# Altium schematic sheet catalog.SchDoc
size A4
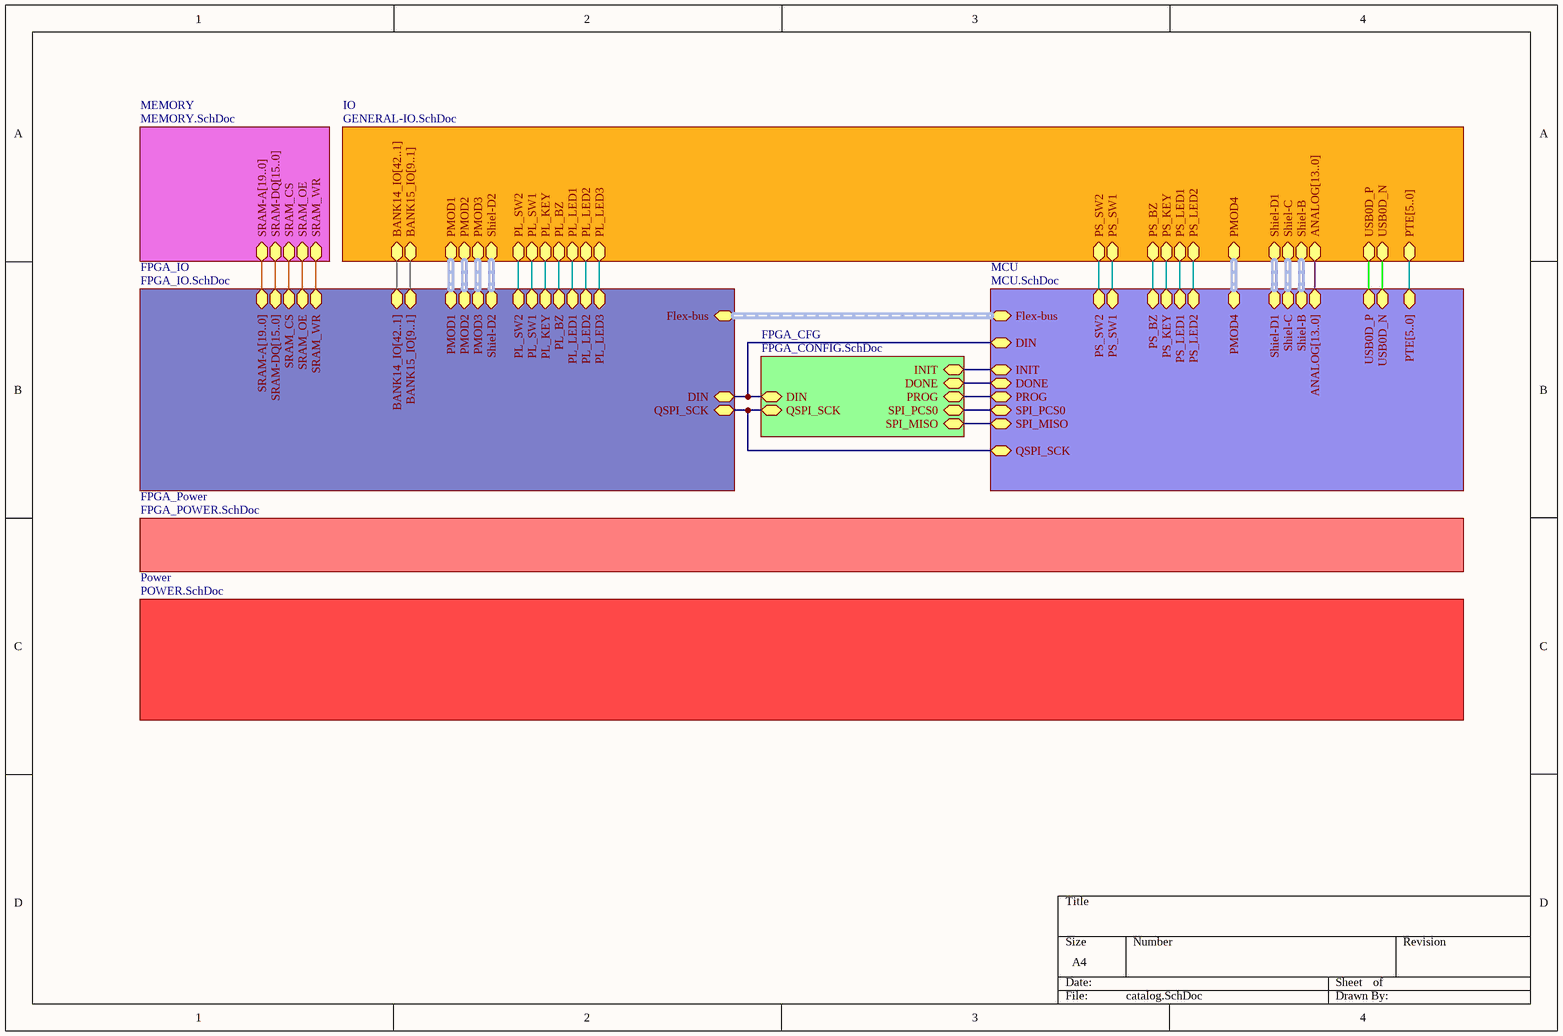
[diagram p0: catalog.SchDoc]

## Sub-sheets
FPGA_CFG = FPGA_CONFIG.SchDoc: QSPI_SCK, DIN, INIT, DONE, PROG, SPI_PCS0, SPI_MISO
FPGA_IO = FPGA_IO.SchDoc: QSPI_SCK, BANK14_IO[42..1], BANK15_IO[9..1], DIN, Flex-bus (harness Flexbus), SRAM-A[19..0] (harness Flexbus), SRAM-DQ[15..0] (harness Flexbus), SRAM_CS, SRAM_OE, SRAM_WR, Shiel-D2 (harness ShielD2), PL_SW2, PL_SW1, PL_KEY, PL_LED1, PL_LED2, PL_LED3, PMOD1 (harness PMOD), PMOD2 (harness PMOD), PMOD3 (harness PMOD), PL_BZ
FPGA_Power = FPGA_POWER.SchDoc: no entries
IO = GENERAL-IO.SchDoc: BANK14_IO[42..1], BANK15_IO[9..1], PTE[5..0] (harness Flexbus), USB0D_P, USB0D_N, ANALOG[13..0], Shiel-B (harness ShielB), PMOD4 (harness PMOD), Shiel-C (harness ShielC), Shiel-D1 (harness ShielD1), Shiel-D2 (harness ShielD2), PS_LED2, PS_LED1, PL_SW2, PL_SW1, PL_KEY, PS_KEY, PS_SW1, PS_SW2, PL_LED1, PL_LED2, PL_LED3, PMOD1 (harness PMOD), PMOD2 (harness PMOD), PMOD3 (harness PMOD), PL_BZ, PS_BZ
MCU = MCU.SchDoc: Flex-bus (harness Flexbus), PTE[5..0] (harness Flexbus), USB0D_N, USB0D_P, ANALOG[13..0], Shiel-B (harness ShielB), PMOD4 (harness PMOD), Shiel-C (harness ShielC), Shiel-D1 (harness ShielD1), DIN, INIT, DONE, PROG, SPI_PCS0, SPI_MISO, QSPI_SCK, PS_LED2, PS_LED1, PS_KEY, PS_SW1, PS_SW2, PS_BZ
MEMORY = MEMORY.SchDoc: SRAM-A[19..0] (harness Flexbus), SRAM-DQ[15..0] (harness Flexbus), SRAM_CS, SRAM_OE, SRAM_WR
Power = POWER.SchDoc: no entries

## Nets
(unnamed): sheet FPGA_IO/QSPI_SCK, sheet FPGA_CFG/QSPI_SCK, sheet MCU/QSPI_SCK
(unnamed): sheet FPGA_IO/DIN, sheet FPGA_CFG/DIN, sheet MCU/DIN
(unnamed): sheet FPGA_IO/SRAM_CS, sheet MEMORY/SRAM_CS
(unnamed): sheet FPGA_IO/SRAM_OE, sheet MEMORY/SRAM_OE
(unnamed): sheet FPGA_IO/SRAM_WR, sheet MEMORY/SRAM_WR
(unnamed): sheet FPGA_IO/PL_SW2, sheet IO/PL_SW2
(unnamed): sheet FPGA_IO/PL_SW1, sheet IO/PL_SW1
(unnamed): sheet FPGA_IO/PL_KEY, sheet IO/PL_KEY
(unnamed): sheet FPGA_IO/PL_LED1, sheet IO/PL_LED1
(unnamed): sheet FPGA_IO/PL_LED2, sheet IO/PL_LED2
(unnamed): sheet FPGA_IO/PL_LED3, sheet IO/PL_LED3
(unnamed): sheet FPGA_IO/PL_BZ, sheet IO/PL_BZ
(unnamed): sheet IO/USB0D_P, sheet MCU/USB0D_P
(unnamed): sheet IO/USB0D_N, sheet MCU/USB0D_N
(unnamed): sheet IO/PS_LED2, sheet MCU/PS_LED2
(unnamed): sheet IO/PS_LED1, sheet MCU/PS_LED1
(unnamed): sheet IO/PS_KEY, sheet MCU/PS_KEY
(unnamed): sheet IO/PS_SW1, sheet MCU/PS_SW1
(unnamed): sheet IO/PS_SW2, sheet MCU/PS_SW2
(unnamed): sheet IO/PS_BZ, sheet MCU/PS_BZ
(unnamed): sheet FPGA_CFG/INIT, sheet MCU/INIT
(unnamed): sheet FPGA_CFG/DONE, sheet MCU/DONE
(unnamed): sheet FPGA_CFG/PROG, sheet MCU/PROG
(unnamed): sheet FPGA_CFG/SPI_PCS0, sheet MCU/SPI_PCS0
(unnamed): sheet FPGA_CFG/SPI_MISO, sheet MCU/SPI_MISO

## Buses and harness runs
bus sheet FPGA_IO/BANK14_IO[42..1] = sheet IO/BANK14_IO[42..1]
bus sheet FPGA_IO/BANK15_IO[9..1] = sheet IO/BANK15_IO[9..1]
bus sheet IO/ANALOG[13..0] = sheet MCU/ANALOG[13..0]
harness sheet FPGA_IO/Flex-bus = sheet MCU/Flex-bus
harness sheet FPGA_IO/PMOD1 = sheet IO/PMOD1
harness sheet FPGA_IO/PMOD2 = sheet IO/PMOD2
harness sheet FPGA_IO/PMOD3 = sheet IO/PMOD3
harness sheet FPGA_IO/Shiel-D2 = sheet IO/Shiel-D2
harness sheet IO/PMOD4 = sheet MCU/PMOD4
harness sheet IO/Shiel-B = sheet MCU/Shiel-B
harness sheet IO/Shiel-C = sheet MCU/Shiel-C
harness sheet IO/Shiel-D1 = sheet MCU/Shiel-D1